# Altium schematic sheet DSO_ADC.SchDoc: Schematic_Name
size A4; CompanyName: University of Melbourne; Engineer: Your Name Here; DocumentNumber: 1; Revision: 0.1; SheetNumber: 1; SheetTotal: 1; Title_Project: Project_Title; StudentNo: Student No.
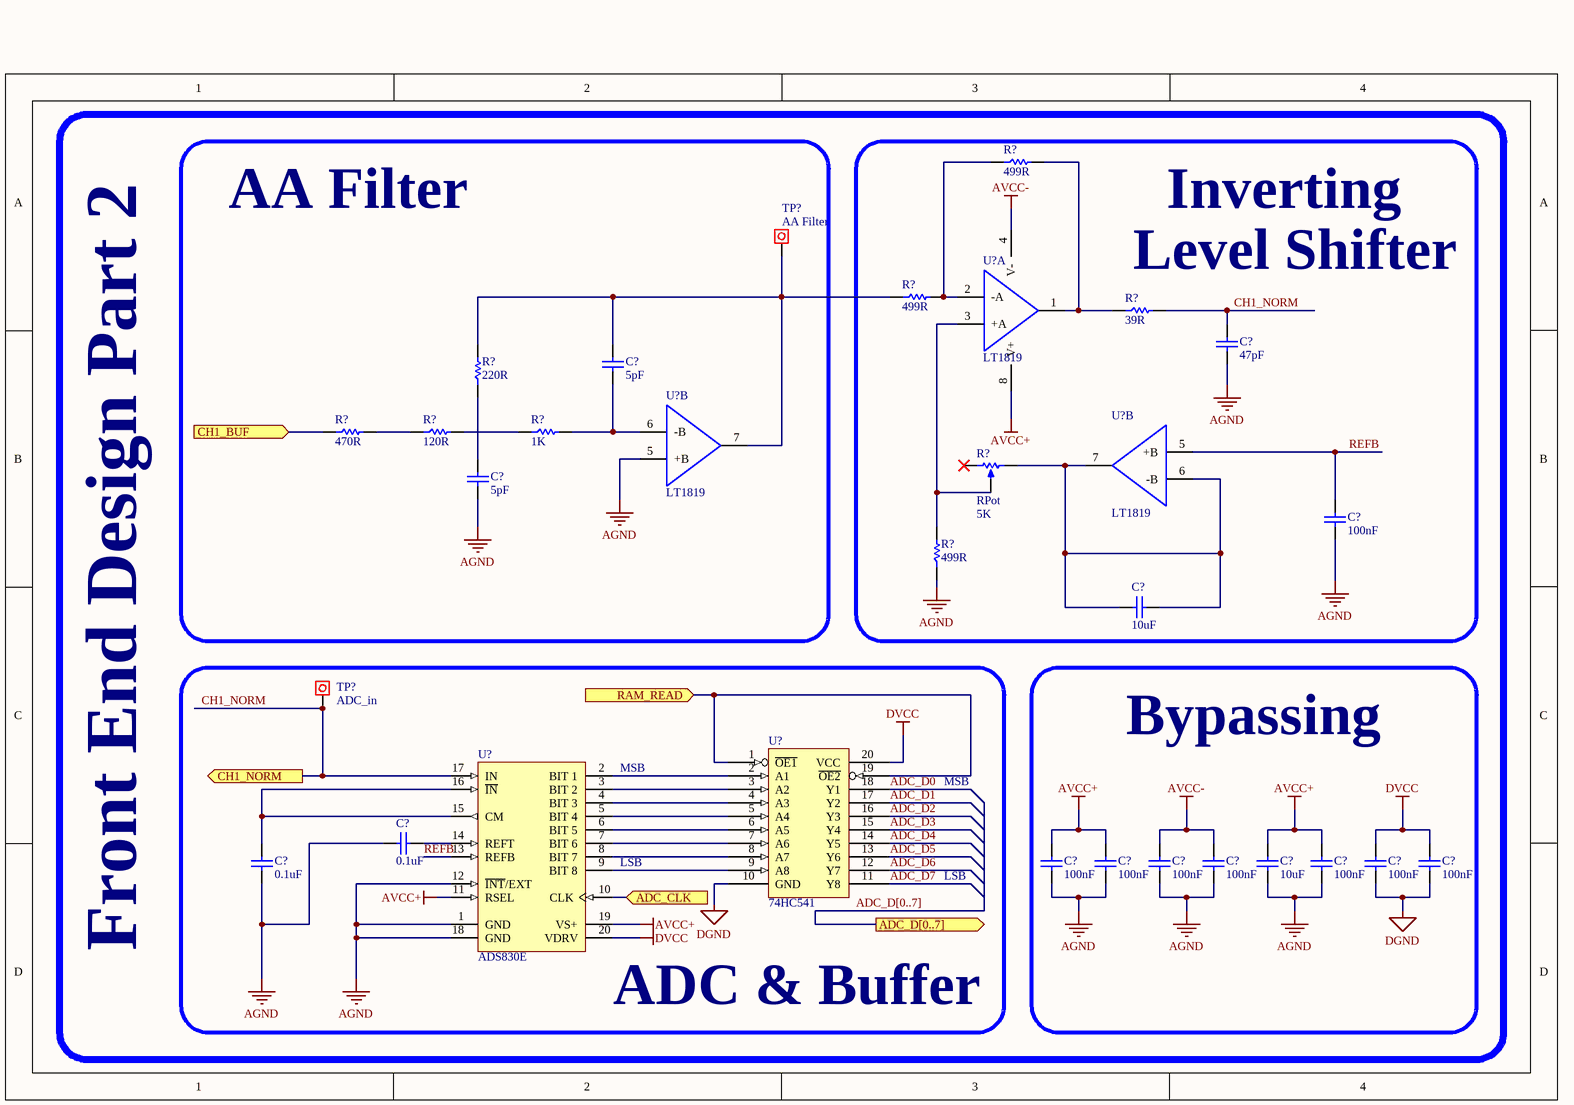
[diagram p0: DSO_ADC.SchDoc]

## Parts
(Parts that share a designator on the sheet are numbered #1, #2 ... from top to bottom, then left to right.)
C?#1  47pF  [0805C]
C?#2  5pF  [0805C]
C?#3  5pF  [0805C]
C?#4  100nF  [0805C]
C?#5  10uF  [0805C]
C?#6  0.1uF  [0805C]
C?#7  100nF  [0805C]
C?#8  100nF  [0805C]
C?#9  100nF  [0805C]
C?#10  100nF  [0805C]
C?#11  10uF  [0805C]
C?#12  100nF  [0805C]
C?#13  100nF  [0805C]
C?#14  100nF  [0805C]
C?#15  0.1uF  [0805C]
R?#1  499R  [0805]
R?#2  499R  [0805]
R?#3  39R  [0805]
R?#4  220R  [0805]
R?#5  470R  [0805]
R?#6  120R  [0805]
R?#7  1K  [0805]
R?#8  RPot  value 5K  [VR5]
R?#9  499R  [0805]
TP?#1  value AA Filter  [Testpoin]  (hidden comment: INPUT)
TP?#2  value ADC_in  [Testpoin]  (hidden comment: INPUT)
U?#1  LT1819  [SOIC-8]  (part A of 2)
U?#2  LT1819  [SOIC-8]  (part B of 2)
U?#3  LT1819  [SOIC-8]  (part B of 2)
U?#4  ADS830E  [TI-DBQ20_L]
U?#5  74HC541  [SOT163-1_N]

## Blocks framed on the sheet
AA Filter: C?#2 C?#3 R?#4-R?#7 TP?#1 U?#3
ADC & Buffer: C?#6 C?#15 TP?#2 U?#4 U?#5
Bypassing: C?#7-C?#14

## Ports
ADC_CLK (in), ADC_D[0..7] (out), CH1_BUF (in), CH1_NORM (out), RAM_READ (in)

## Nets
AGND: C?#1.2 C?#3.2 C?#4.2 C?#6.1 C?#7.1 C?#8.1 C?#9.1 C?#10.1 C?#11.1 C?#12.1 C?#15.2 R?#9.1 U?#3.5(+B) U?#4.1(GND) U?#4.12(~{INT}/EXT) U?#4.18(GND)
AVCC+: C?#7.2 C?#8.2 C?#11.2 C?#12.2 U?#1.8(V+) U?#4.11(RSEL) U?#4.19(VS+)
AVCC-: C?#9.2 C?#10.2 U?#1.4(V-)
DGND: C?#13.1 C?#14.1 U?#5.10(GND)
DVCC: C?#13.2 C?#14.2 U?#4.20(VDRV) U?#5.20(VCC)
ADC_CLK: U?#4.10(CLK) ; port ADC_CLK
ADC_D0: U?#5.18(Y1)
ADC_D1: U?#5.17(Y2)
ADC_D2: U?#5.16(Y3)
ADC_D3: U?#5.15(Y4)
ADC_D4: U?#5.14(Y5)
ADC_D5: U?#5.13(Y6)
ADC_D6: U?#5.12(Y7)
ADC_D7: U?#5.11(Y8)
CH1_BUF: R?#5.1 ; port CH1_BUF
CH1_NORM: C?#1.1 R?#3.2 TP?#2.1 U?#4.17(IN) ; port CH1_NORM
RAM_READ: U?#5.1(~{OE1}) U?#5.19(~{OE2}) ; port RAM_READ
REFB: C?#4.1 U?#2.5(+B) U?#4.13(REFB)
NetC?#2_1: C?#2.1 R?#2.1 R?#4.2 TP?#1.1 U?#3.7(OUTB)
NetC?#2_2: C?#2.2 R?#7.2 U?#3.6(-B)
NetC?#3_1: C?#3.1 R?#4.1
NetC?#5_1: C?#5.1 C?#5.2 R?#8.3(BOT) U?#2.6(-B) U?#2.7(OUTB)
NetC?#6_2: C?#6.2 U?#4.15(CM) U?#4.16(~{IN})
NetC?#15_1: C?#15.1 U?#4.14(REFT)
NetR?#1_1: R?#1.1 R?#2.2 U?#1.2(-A)
NetR?#1_2: R?#1.2 R?#3.1 U?#1.1(OUTA)
NetR?#5_2: R?#5.2 R?#6.1
NetR?#6_2: R?#6.2 R?#7.1
NetR?#8_2: R?#8.2(TAP) R?#9.2 U?#1.3(+A)
NetU?#4_2: U?#4.2(BIT_1) U?#5.2(A1)
NetU?#4_3: U?#4.3(BIT_2) U?#5.3(A2)
NetU?#4_4: U?#4.4(BIT_3) U?#5.4(A3)
NetU?#4_5: U?#4.5(BIT_4) U?#5.5(A4)
NetU?#4_6: U?#4.6(BIT_5) U?#5.6(A5)
NetU?#4_7: U?#4.7(BIT_6) U?#5.7(A6)
NetU?#4_8: U?#4.8(BIT_7) U?#5.8(A7)
NetU?#4_9: U?#4.9(BIT_8) U?#5.9(A8)

Not connected (* = marked no-connect by the designer): R?#8 1(TOP)*

## Buses and harness runs
bus ADC_D[0..7] = port ADC_D[0..7]

## Notes on the sheet
- Inverting
- (near R?#3) Level Shifter
- (near U?#4) MSB
- MSB
- (near U?#4) LSB
- LSB
- Front End Design Part 2

## Library data of the parts
C?#1-C?#15 = C: Capacitor; Reviewed by: RM - 2018/08/05; Revision: July-2002: Re-released for DXP Platform.; Supplier 1: *; Supplier Part Number 1: *
  C?#1: Value: 47pF
  C?#2 C?#3: Value: 5pF
  C?#4 C?#7-C?#10 C?#12-C?#14: Value: 100nF
  C?#5 C?#11: Value: 10uF
  C?#6 C?#15: Value: 0.1uF
R?#1-R?#7 R?#9 = R: Resistor; Reviewed by: RM - 2018/08/05; Supplier 1: *; Suppler Part Number 1: *
  R?#1 R?#2 R?#9: Value: 499R
  R?#3: Value: 39R
  R?#4: Value: 220R
  R?#5: Value: 470R
  R?#6: Value: 120R
  R?#7: Value: 1K
R?#8 = RPot: Potentiometer; Sim Note: Enter the Resistance value and the set point into parameter fields.; Set Position: 0.5; Published: 8-Jun-2000; LatestRevisionDate: 17-Jul-2002; LatestRevisionNote: Re-released for DXP Platform.; PackageReference: VR5; Publisher: Altium Limited; PackageDescription: Variable Resistor, Thru-Hole; 3 Leads
TP?#1 TP?#2 = Test Point: Pad
U?#1-U?#3 = LT1819: OpAmp High Frequency Dual; Reviewed by: RM - 2018/08/05; Supplier 1: Digi-Key; Supplier Part Number 1: LT1819CMS8#PBF-ND
U?#4 = ADS830E: 8-Bit, 60 MSPS ADC Single-Ended / Differential Input, Internal / External Reference and Programmble Input Range, -40 to 85 degC, 20-pin SOP (DBQ20), Green (RoHS & no Sb/Br); Reviewed by: RM - 2018/08/05; ComponentLink2URL: http://www.ti.com/general/docs/lit/getliterature.tsp?genericPartNumber=ADS830&fileType=pdf; ComponentLink2Description: Datasheet; ComponentLink1URL: http://www.ti.com/; ComponentLink3URL: http://www.ti.com/litv/pdf/mpds210a; ComponentLink3Description: Package Specification; ComponentLink1Description: Manufacturer URL; Supplier 1: Digi-Key; Supplier Part Number 1: ADS830E-ND
U?#5 = 74HC541: (ADV) Octal Buffer, Line Driver; Reviewed by: RM - 2018/08/05; Supplier 1: Digi-Key; Supplier Part Number 1: 296-1202-1-ND